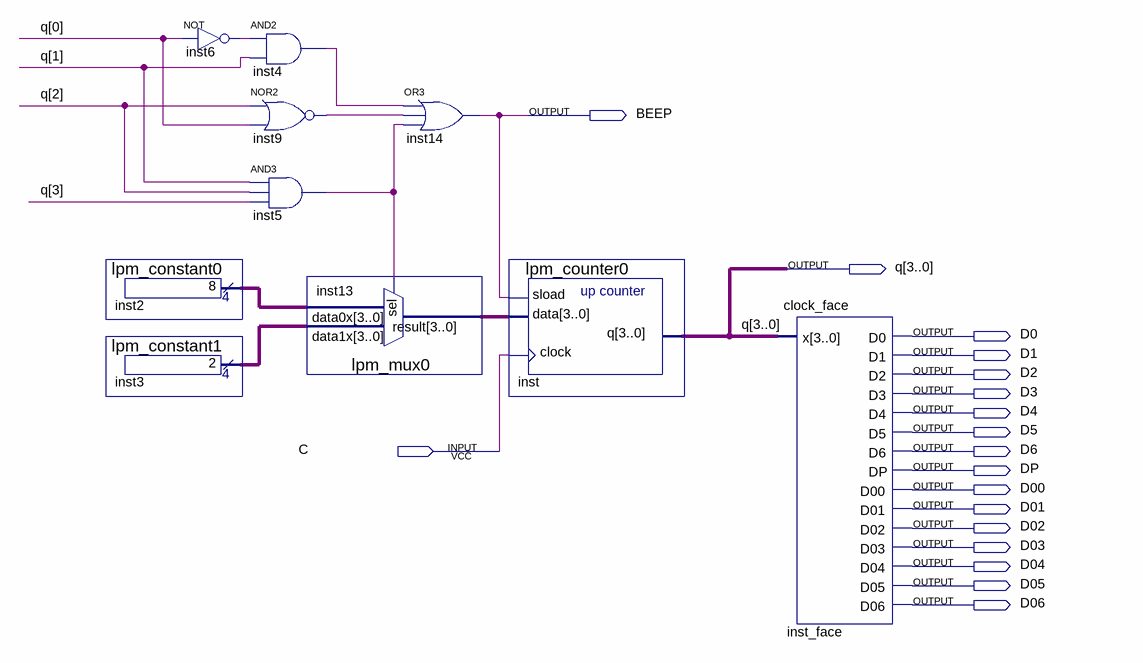
[diagram p0: schematic sheet]
// Quartus schematic 7_2.bdf as structural Verilog: 10 symbols, 18 pins
module \7_2  (
  input  C,
  output BEEP,
  output [3:0] q,
  output D0,
  output D1,
  output D2,
  output D3,
  output D4,
  output D5,
  output D6,
  output DP,
  output D00,
  output D01,
  output D02,
  output D03,
  output D04,
  output D05,
  output D06
);

  wire inst4_out, inst5_out, inst6_out, inst9_out;
  wire [3:0] inst2_result, inst3_result, inst13_result;

  lpm_constant0 inst2 (.result(inst2_result));
  lpm_constant1 inst3 (.result(inst3_result));
  not inst6 (inst6_out, q[0]);
  and inst4 (inst4_out, inst6_out, q[1]);
  nor inst9 (inst9_out, q[2], q[0]);
  and inst5 (inst5_out, q[1], q[2], q[3]);
  lpm_mux0 inst13 (.data1x(inst3_result), .data0x(inst2_result), .sel(inst5_out), .result(inst13_result));
  or inst14 (BEEP, inst4_out, inst9_out, inst5_out);
  lpm_counter0 inst (.sload(BEEP), .data(inst13_result), .clock(C), .q(q));
  clock_face inst_face (
    .x(q), .D0(D0), .D1(D1), .D2(D2), .D3(D3), .D4(D4), .D5(D5), .D6(D6), .DP(DP), .D00(D00), .D01(D01),
    .D02(D02), .D03(D03), .D04(D04), .D05(D05), .D06(D06));
endmodule
